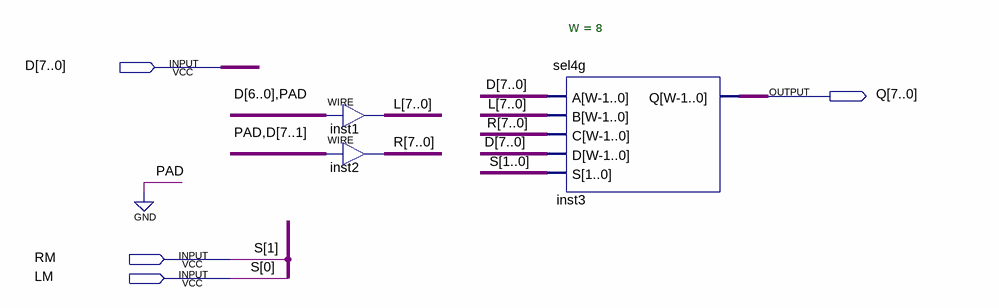
[diagram p0: schematic sheet]
// Quartus schematic shifter.bdf as structural Verilog: 3 symbols, 4 pins
module shifter (
  input  [7:0] D,
  input  RM,
  input  LM,
  output [7:0] Q
);

  wire [7:0] L, R;

  assign L = {D[6:0], 1'b0};  // WIRE inst1
  assign R = {1'b0, D[7:1]};  // WIRE inst2
  sel4g #(.W(8)) inst3 (.A(D), .B(L), .C(R), .D(D), .S({RM, LM}), .Q(Q));

  // Other names for the same wires on the sheet: S[1:0] = {RM, LM}
endmodule
